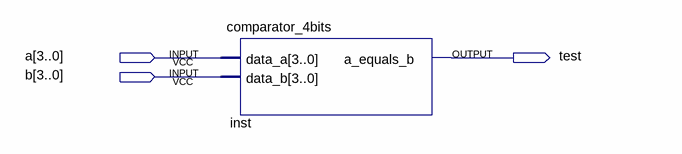
[diagram p0: schematic sheet]
// Quartus schematic comparator_4bits_test.bdf as structural Verilog: 1 symbols, 3 pins
module comparator_4bits_test (
  input  [3:0] a,
  input  [3:0] b,
  output test
);

  comparator_4bits inst (.data_a(a), .data_b(b), .a_equals_b(test));
endmodule
